# EAGLE schematic NW700 (EAGLE 7.4.0)
Neewer NW-700 Schematic. Based on analysis <http://www.audioimprov.com/AudioImprov/Mics/Entries/2014/12/18_Another_Chinese_mic_Circuit.html> by Henry Spragens.
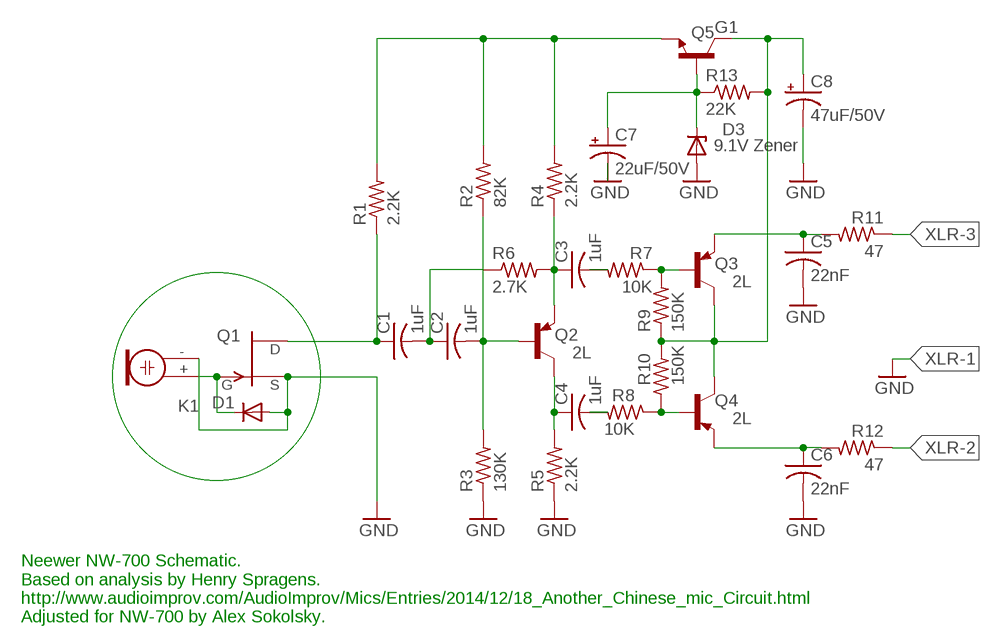
[diagram p0: schematic, sheet 1]

## Parts
C1  1uF  C-US050-025X075  [C050-025X075]
C2  1uF  C-US050-025X075  [C050-025X075]
C3  1uF  C-US050-025X075  [C050-025X075]
C4  1uF  C-US050-025X075  [C050-025X075]
C5  22nF  C-US050-025X075  [C050-025X075]
C6  22nF  C-US050-025X075  [C050-025X075]
C7  22uF/50V  CPOL-USB45181C  [B45181C]
C8  47uF/50V  CPOL-USB45181C  [B45181C]
D1  1N4004  [DO41-10]
D3  9.1V Zener  ZENER-DIODEDO35Z10  [DO35Z10]
K1  ELECTRET  [9.7ELECTRET]
Q1  2N5950  [TO-92]
Q2  2L  2N2907  [TO92-EBC-OVAL]
Q3  2L  2N2907  [TO92-EBC-OVAL]
Q4  2L  2N2907  [TO92-EBC-OVAL]
Q5  G1  2N3565  [TO92]
R1  2.2K  R-US_0204/7  [0204/7]
R2  82K  R-US_0204/7  [0204/7]
R3  130K  R-US_0204/7  [0204/7]
R4  2.2K  R-US_0204/7  [0204/7]
R5  2.2K  R-US_0204/7  [0204/7]
R6  2.7K  R-US_0204/7  [0204/7]
R7  10K  R-US_0204/7  [0204/7]
R8  10K  R-US_0204/7  [0204/7]
R9  150K  R-US_0204/7  [0204/7]
R10  150K  R-US_0204/7  [0204/7]
R11  47  R-US_0204/7  [0204/7]
R12  47  R-US_0204/7  [0204/7]
R13  22K  R-US_0204/7  [0204/7]

## Nets
GND: C5.2 C6.2 C8.- D1.A K1.- Q1.2(S) R3.1
N$1: C3.1 Q2.E R4.1 R6.2
N$2: C5.1 Q3.E R11.2
N$4: C4.1 Q2.C R5.2
N$5: C8.+ Q3.C Q4.C Q5.1(C) R9.1 R10.2 R13.2
N$6: Q3.B R7.1 R9.2
N$7: Q4.B R8.1 R10.1
N$8: D1.C K1.+ Q1.1(G)
N$9: C7.+ D3.C Q5.2(B) R13.1
N$10: C6.1 Q4.E R12.2
N$11: C3.2 R7.2
N$12: C4.2 R8.2
N$13: C2.2 Q2.B R2.1 R3.2
N$14: C1.2 C2.1 R6.1
N$15: C1.1 Q1.3(D) R1.1
N$16: Q5.3(E) R1.2 R2.2 R4.2
XLR-1: C7.- D3.A R5.1 ; supply symbol labelled GND
XLR-2: R12.1
XLR-3: R11.1

## Notes on the sheet
- Neewer NW-700 Schematic.
  Based on analysis by Henry Spragens.
  http://www.audioimprov.com/AudioImprov/Mics/Entries/2014/12/18_Another_Chinese_mic_Circuit.html
  Adjusted for NW-700 by Alex Sokolsky.

## Library data of the parts
C1-C6 = adafruit:C-US: CAPACITOR, American symbol
C7 C8 = adafruit:CPOL-US: POLARIZED CAPACITOR, American symbol
D1 = adafruit:1N4004: DIODE General purpose 1N400x type rectifier (With bigger pads) http://www.ladyada.net/library/pcb/eaglelibrary.html
D3 = diode:ZENER-DIODE: Z-Diode
K1 = adafruit:ELECTRET: Electret microphone Thru hole 2.54mm spacing with 9.7mm diameter
Q1 = transistor-fet:2N5950: N-Channel JFET RF Amplifier
Q2-Q4 = adafruit:2N2907*: PNP Transistor Big Oval pads
Q5 = transistor:2N3565: NPN TRANSISTOR
R1-R13 = adafruit:R-US_: RESISTOR, American symbol